# Altium schematic sheet powerSTEP01.SchDoc
size A4; SheetNumber: 5; SheetTotal: 5
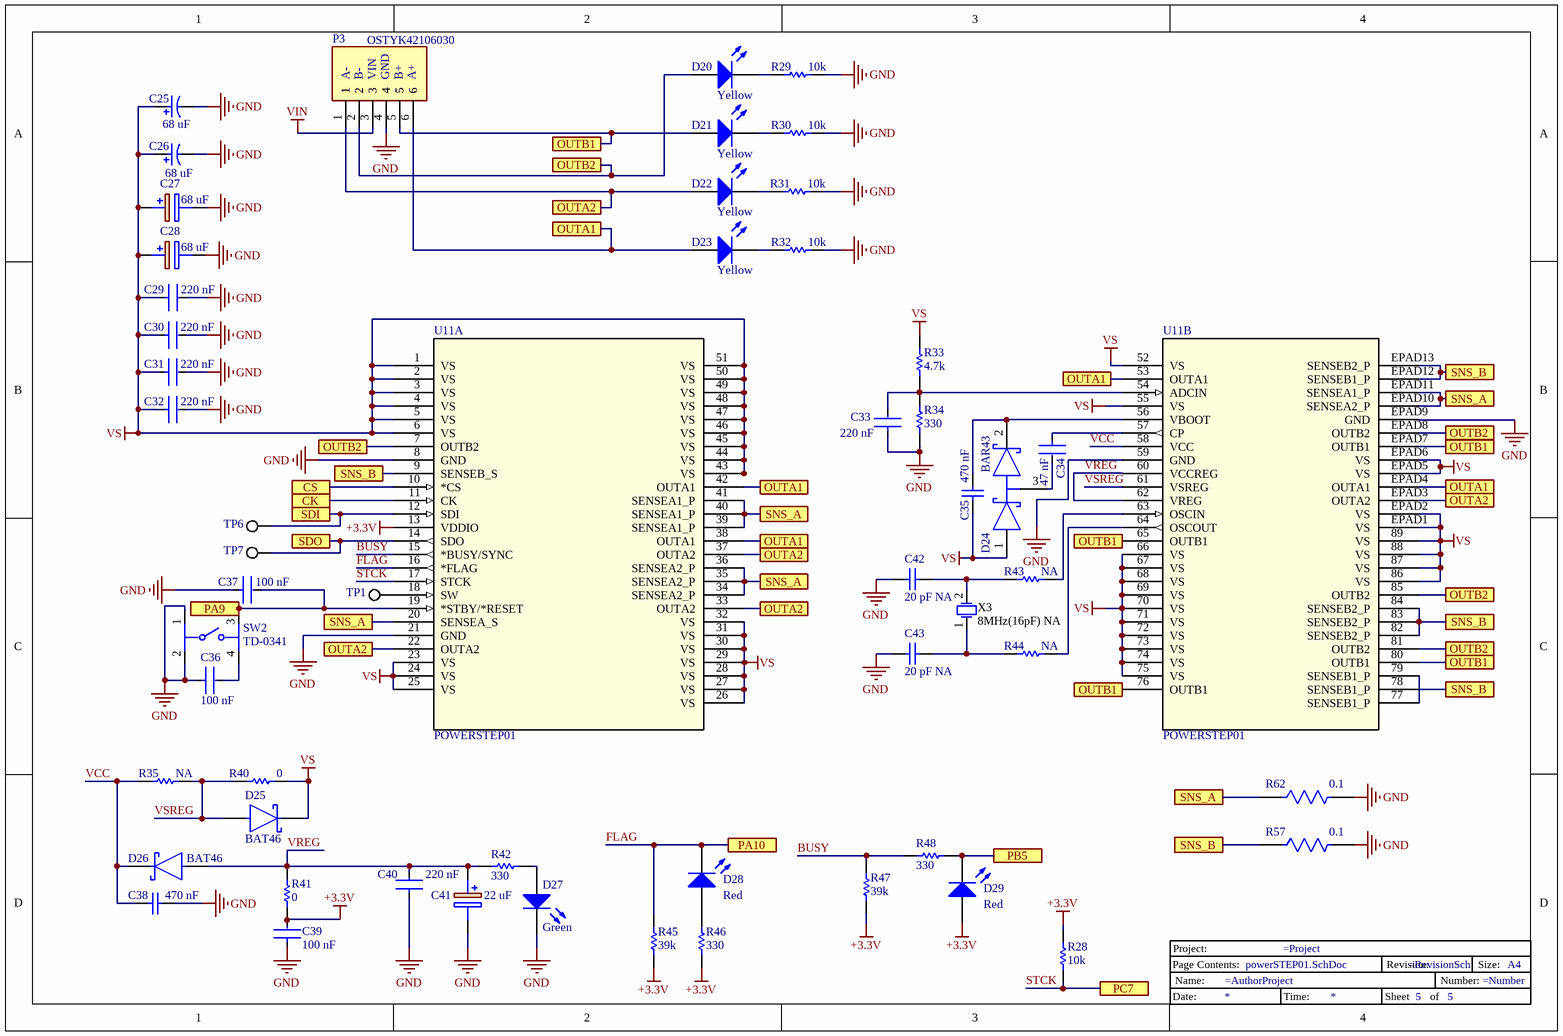
[diagram p0: powerSTEP01.SchDoc]

## Parts
C25  68 uF  [NIC-CAPA2-8X10_V]
C26  68 uF  [NIC-CAPA2-8X10_V]
C27  68 uF  [CAPPRD350W65D800H1300]
C28  68 uF  [CAPPRD350W65D800H1300]
C29  220 nF  [FP-C0805C-DN-MFG]
C30  220 nF  [FP-C0805C-DN-MFG]
C31  220 nF  [FP-C0805C-DN-MFG]
C32  220 nF  [FP-C0805C-DN-MFG]
C33  220 nF  [FP-C0805C-DN-MFG]
C34  47 nF  [FP-CL21-IPC_B]
C35  470 nF  [CAPC1608X90X35ML10T15]
C36  100 nF  [FP-CC0603-DA-MFG]
C37  100 nF  [FP-CC0603-DA-MFG]
C38  470 nF  [CAPC1608X90X35ML10T15]
C39  100 nF  [FP-CC0603-DA-MFG]
C40  220 nF  [FP-C0805C-DN-MFG]
C41  22 uF  [CAPPM3216X180N]
C42  20 pF NA  [CAPC1608X90X35NL15T15]
C43  20 pF NA  [CAPC1608X90X35NL15T15]
D20  Yellow  [0805_A]
D21  Yellow  [0805_A]
D22  Yellow  [0805_A]
D23  Yellow  [0805_A]
D24  BAR43  [FP-SOT23-3L-MFG]
D25  BAT46  [FP-S8-V-3910_01-001-MFG]
D26  BAT46  [FP-S8-V-3910_01-001-MFG]
D27  Green  [0805_A]
D28  Red  [0805_A]
D29  Red  [0805_A]
P3  OSTYK42106030  [OSTYK42106030]
R28  10k  [RESC1608X55X25ML10T15]
R29  10k  [RESC1608X55X25ML10T15]
R30  10k  [RESC1608X55X25ML10T15]
R31  10k  [RESC1608X55X25ML10T15]
R32  10k  [RESC1608X55X25ML10T15]
R33  4.7k  [RESC1609X50X30NL8T20]
R34  330  [RESC1608X55X30LL20T20]
R35  NA  [RESC1608X55X25ML10T15]
R40  0  [RESC1608X55X25ML10T15]
R41  0  [RESC1608X55X25ML10T15]
R42  330  [RESC1608X55X30LL20T20]
R43  NA  [RESC1608X55X25ML10T15]
R44  NA  [RESC1608X55X25ML10T15]
R45  39k  [RESC1608X55X30LL20T20]
R46  330  [RESC1608X55X30LL20T20]
R47  39k  [RESC1608X55X30LL20T20]
R48  330  [RESC1608X55X30LL20T20]
R57  0.1  [FP-WSL2512-MFG]
R62  0.1  [FP-WSL2512-MFG]
SW2  TD-0341  [FP-1571563-9-MFG]
Title_Block_5  Title_Block  (value not drawn)
TP1  5000  [KSTN-5002]  (value not drawn)
TP6  5000  [KSTN-5002]  (value not drawn)
TP7  5000  [KSTN-5002]  (value not drawn)
U11  POWERSTEP01  [VFQFPN89_11X14X1_STM]  (parts A,B of 2)
X3  8MHz(16pF) NA  [FOX-FOXSLF160-20]

## Ports
CK, CS, OUTA1, OUTA2, OUTB1, OUTB2, PA9, PA10, PB5, PC7, SDI, SDO, SNS_A, SNS_B

## Nets
+3.3V: C39.2 D29.2(A) R28.2 R41.2 R45.1 R46.1 R47.1 U11.13(VDDIO)
GND: C25.2 C26.2 C27.2(-) C28.2(-) C29.2 C30.2 C31.2 C32.2 C33.1 C36.1 C37.1 C38.1 C39.1 C40.1 C41.2(-) C42.1 C43.1 D27.1(K) P3.4 R29.2 R30.2 R31.2 R32.2 R34.1 R57.2 R62.2 SW2.1 SW2.2 U11.8(GND) U11.21(GND) U11.59(GND) U11.EPAD9(GND)
VIN: P3.3
VS: C25.1 C26.1 C27.1(+) C28.1(+) C29.1 C30.1 C31.1 C32.1 C35.1 D24.1(A2) D25.1(C) R33.2 R40.2 U11.1(VS) U11.2(VS) U11.3(VS) U11.4(VS) U11.5(VS) U11.6(VS) U11.23(VS) U11.24(VS) U11.25(VS) U11.26(VS) U11.27(VS) U11.28(VS) U11.29(VS) U11.30(VS) U11.31(VS) U11.32(VS) U11.43(VS) U11.44(VS) U11.45(VS) U11.46(VS) U11.47(VS) U11.48(VS) U11.49(VS) U11.50(VS) U11.51(VS) U11.52(VS) U11.55(VS) U11.66(VS) U11.67(VS) U11.68(VS) U11.69(VS) U11.70(VS) U11.71(VS) U11.72(VS) U11.73(VS) U11.74(VS) U11.75(VS) U11.86(VS) U11.87(VS) U11.88(VS) U11.89(VS) U11.EPAD1(VS) U11.EPAD2(VS) U11.EPAD5(VS) U11.EPAD6(VS)
BUSY: R47.2 R48.2 U11.15(*BUSY/SYNC)
CK: U11.11(CK) ; port CK
CS: U11.10(*CS) ; port CS
FLAG: D28.1(K) R45.2 U11.16(*FLAG) ; port PA10
OUTA1: D23.2(A) P3.6 U11.38(OUTA1) U11.42(OUTA1) U11.53(OUTA1) U11.EPAD4(OUTA1) ; port OUTA1
OUTA2: D22.2(A) P3.1 U11.22(OUTA2) U11.33(OUTA2) U11.37(OUTA2) U11.EPAD3(OUTA2) ; port OUTA2
OUTB1: D21.2(A) P3.5 U11.65(OUTB1) U11.76(OUTB1) U11.80(OUTB1) U11.EPAD7(OUTB1) ; port OUTB1
OUTB2: D20.2(A) P3.2 U11.7(OUTB2) U11.81(OUTB2) U11.85(OUTB2) U11.EPAD8(OUTB2) ; port OUTB2
PA9: C37.2 SW2.3 U11.19(*STBY/*RESET) ; port PA9
PB5: D29.1(K) R48.1 ; port PB5
SDI: TP6.1 U11.12(SDI) ; port SDI
SDO: TP7.1 U11.14(SDO) ; port SDO
SNS_A: R62.1 U11.20(SENSEA_S) U11.34(SENSEA2_P) U11.35(SENSEA2_P) U11.36(SENSEA2_P) U11.39(SENSEA1_P) U11.40(SENSEA1_P) U11.41(SENSEA1_P) U11.EPAD10(SENSEA2_P) U11.EPAD11(SENSEA1_P) ; port SNS_A
SNS_B: R57.1 U11.9(SENSEB_S) U11.77(SENSEB1_P) U11.78(SENSEB1_P) U11.79(SENSEB1_P) U11.82(SENSEB2_P) U11.83(SENSEB2_P) U11.84(SENSEB2_P) U11.EPAD12(SENSEB1_P) U11.EPAD13(SENSEB2_P) ; port SNS_B
STCK: R28.1 U11.17(STCK) ; port PC7
VCC: C38.2 D26.1(C) R35.1 U11.58(VCC)
VREG: C40.2 C41.1(+) D26.2(A) R41.1 R42.2 U11.60(VCCREG) U11.62(VREG)
VSREG: D25.2(A) R35.2 R40.1 U11.61(VSREG)
NetC33_2: C33.2 R33.1 R34.2 U11.54(ADCIN)
NetC34_1: C34.1 U11.57(CP)
NetC34_2: C34.2 D24.3(A1/K2)
NetC35_2: C35.2 D24.2(K1) U11.56(VBOOT)
NetC36_2: C36.2 SW2.4
NetC42_2: C42.2 R43.1 X3.2
NetC43_2: C43.2 R44.1 X3.1
NetD20_1: D20.1(K) R29.1
NetD21_1: D21.1(K) R30.1
NetD22_1: D22.1(K) R31.1
NetD23_1: D23.1(K) R32.1
NetD27_2: D27.2(A) R42.1
NetD28_2: D28.2(A) R46.2
NetR43_2: R43.2 U11.63(OSCIN)
NetR44_2: R44.2 U11.64(OSCOUT)
NetTP1_1: TP1.1 U11.18(SW)

## Notes on the sheet
- (near P3) A-
- (near P3) B-
- (near P3) VIN
- (near P3) GND
- (near P3) B+
- (near P3) A+
- (in symbol Title_Block) Project:; Page Contents:; Revision:; Size:; A4; Name:; Number:; Date:; Time:; Sheet; of

## Library data of the parts
C25 C26 = CMP-0687-00076-1: Aluminum Electrolytic Capacitor, UD Series, Low Impedance, 68 uF, 50 V, + / - 20%, -55 to 105 degC, Chip Type, 8 x 10 mm D x L, Pb-Free, Reel UUD1H680MNL1GS; Manufacturer: Nichicon; Endurance Time: 2000 h; Rated Ripple Current (at 100kHz): 300 mA; Packing: Dia382mm Reel; Impedance: 0.34 Ohm; Tolerance Rated Capacitance: -20 to 20%; Rated Voltage: 50 V; ComponentLink3URL: http://products.nichicon.co.jp/en/pdf/XJA043/e-ud.pdf; ComponentLink2Description: Datasheet; Length: 10 mm; ComponentLink1Description: Manufacturer URL; ComponentLink3Description: Package Specification; ComponentLink2URL: http://products.nichicon.co.jp/en/pdf/XJA043/e-ud.pdf; PackageReference: CAPAE-D8H10; Rated Capacitance: 68 uF; PackageDescription: 2-Pin Surface Mount Device, Diameter 8 mm, Height 10 mm, Pitch 6.5 mm; RoHS: TRUE; PartNumber: UUD1H680MNL1GS; Mounting Technology: Surface Mount; DatasheetVersion: 08/2012; Diameter: 8 mm; ComponentLink1URL: http://www.nichicon.co.jp/
C27 C28 = EEU-FC1H680B: Capacitor Polarised; Manufacturer_Name: Panasonic; Datasheet Link: https://componentsearchengine.com/Datasheets/1/EEU-FC1H680B.pdf; Height: 13mm; Manufacturer_Part_Number: EEU-FC1H680B; Mouser Part Number: 667-EEU-FC1H680B; Mouser Price/Stock: https://www.mouser.co.uk/ProductDetail/Panasonic/EEU-FC1H680B?qs=LJ9%2FzSqIxRzRhFJo5GKaVg%3D%3D; Arrow Part Number: EEU-FC1H680B; Arrow Price/Stock: https://www.arrow.com/en/products/eeu-fc1h680b/panasonic
C29-C33 C40 = CMP-1036-04552-2: CAP CER 0.22UF 50V X7R 0805; Manufacturer: KEMET; Manufacturer Part Number: C0805C224K5RACTU; Value: 0.22 μF; Temperature Coefficient: 30ppm/°C; Material: Ceramic; Tolerance: 0.1; ComponentLink2URL: https://content.kemet.com/datasheets/KEM_C1003_C0G_SMD.pdf; Temperature Characteristic: X7R; Device Class L3: Ceramic Capacitors; Lead Free: Yes; Temperature: -55°C to +125°C; RoHS: TRUE; Capacitance: 0.22 μF; Automotive: No; Octopart: https://octopart.com/c0805c224k5ractu-kemet-144670; Temperature Range Low: -55°C; Height: 0.88mm; Device Class L1: Passive Components; Digikey Description: CAP CER 0.22UF 50V X7R 0805; ComponentLink2Description: Datasheet; Mouser Description: CAP CER 0.22UF 50V X7R 0805; Category: Cap; Ipc Land Pattern Name: CAPC200125X78; Temperature Range High: +125°C; Package: C0805C-DN; Device Class L2: Capacitors; Voltage Rating: 50 V
C34 = CMP-13271-004199-1: CL21 Series 0805 47nF 50V ±5% Tolerance X7R Multilayer Ceramic Chip Capacitor; Thickness: 0.037inch; Length: 2mm; Voltage Rating (DC): 50V; Width: 0.049inch; Case/Package: 0805; Mount: Surface Mount; Case Code (Imperial): 0805; Package Quantity: 1; Capacitance: 47nF; Packaging: Tape and Reel; Voltage: 50V; Material: Ceramic; Max Operating Temperature: 125°C; Radiation Hardening: No; Min Operating Temperature: -55°C; Height: 0.85mm; Voltage Rating: 50V; Depth: 1.25mm; Tolerance: 5%; Case Code (Metric): 2012; Dielectric: X7R
C35 C38 = CMP-2006-02821-1: Part Number: GRM188R61E474KA12D; Manufacturer: Murata
C36 C37 C39 = CMP-2100-03601-2: CAP CER 0.1UF 50V X7R 0603; Manufacturer: YAGEO; Manufacturer Part Number: CC0603KRX7R9BB104; Material: Ceramic; Temperature Coefficient: 15%; Tolerance: 0.1; Height: 0.9mm; Voltage: 50 V; ComponentLink2Description: Datasheet; Device Class L2: Capacitors; Temperature Range High: +125°C; Category: Cap; Capacitance: 100 nF; Footprint Url: http://www.yageo.com/exep/pages/download/literatures/UPY-C_GEN_24.pdf; ComponentLink2URL: http://www.yageo.com/documents/recent/UPY-GPHC_X7R_6.3V-to-50V_18.pdf; Package: CC0603-DA; Temperature: -55°C to +125°C; Voltage Rating: 50 V; Temperature Characteristic: X7R; Device Class L1: Passive Components; Temperature Range Low: -55°C; RoHS: TRUE; Automotive: No; Value: 100 nF; Device Class L3: Ceramic Capacitors; Octopart: https://octopart.com/cc0603krx7r9bb104-yageo-42244635; Mouser Description: Multilayer Ceramic Capacitor, CC Series, 0.1 - F, - 10%, X7R, 50 V, 0603 [1608 Metric]; Lead Free: Yes; Digikey Description: CAP CER 0.1UF 50V X7R 0603
C41 = T495A226K006ATE500: Capacitor Polarised 22 uF TANT; Manufacturer_Name: Kemet; Datasheet Link: https://componentsearchengine.com/Datasheets/2/T495A226K006ATE500.pdf; Height: 1.8mm; Manufacturer_Part_Number: T495A226K006ATE500; Mouser Part Number: 80-T495A226K06ATE500; Mouser Price/Stock: https://www.mouser.com/Search/Refine.aspx?Keyword=80-T495A226K06ATE500; Arrow Part Number: T495A226K006ATE500; Arrow Price/Stock: https://www.arrow.com/en/products/t495a226k006ate500/kemet-corporation
C42 C43 = CMP-2006-04264-1: Part Number: 06035A200JAT2A; Manufacturer: AVX Interconnect / Elco
D20-D23 = CMP-1426-00012-1: SMD mono-color Chip LED, WL-SMCW, Yellow; Manufacturer: Wuerth Elektronik; PartNumber: 150080YS75000; Color: Yellow; ComponentLink1URL: http://www.we-online.com; PackageReference: 0805_A; ComponentLink2URL: http://katalog.we-online.com/led/datasheet/150080YS75000.pdf; ComponentLink1Description: Manufacturer URL; ComponentLink2Description: Datasheet
D24 = CMP-2000-05915-2: DIODE ARRAY SCHOTTKY 30V SOT23-3; Manufacturer: STMicroelectronics; Manufacturer Part Number: BAR43SFILM; Forward Current: 0.1A; Peak Reverse Current: 0.5uA; Standoff Height: 0mm; Value: 7pF; Max Junction Temp: +150°C; Max Surge Forward Current: 0.75A; Max Repetitive Reverse Voltage: 30V; ComponentLink2Description: Datasheet; Mouser Description: Schottky Diodes & Rectifiers 100mA 30 Volt; Octopart: https://octopart.com/bar43sfilm-stmicroelectronics-39549077; Temperature: to +150°C; Category: Diode; Lead Free: Yes; Device Class L3: Schottky Diodes; Device Class L1: Discrete Semiconductors; RoHS: TRUE; ComponentLink2URL: https://www.st.com/resource/en/datasheet/bar43.pdf; Device Class L2: Diodes; Package: SOT23-3L; Height: 1.5mm; Automotive: No; Capacitance: 7pF; Temperature Range High: +150°C; Digikey Description: DIODE ARRAY SCHOTTKY 30V SOT23-3
D25 D26 = CMP-02539-000007-1: DIODE SCHOTTKY 100V 150MA SOD123; Manufacturer Part Number: BAT46W-E3-08; Manufacturer: Vishay; Max Junction Temp: +125°C; Capacitance: 10pF; Max Surge Forward Current: 750mA; Value: 10pF; Peak Reverse Current: 5uA; Automotive: No; ComponentLink2URL: http://www.vishay.com/docs/85663/bat46wv.pdf; Reverse Voltage: 100V; Max Repetitive Reverse Voltage: 100V; Mouser Description: BAT46W Series 100 V 150 mA Surface Mount Small Signal Schottky Diode - SOD-123; Device Class L2: Diodes; Temperature Range High: +125°C; Temperature: -55°C to +125°C; Category: Diode; ComponentLink2Description: Datasheet; Device Class L3: Schottky Diodes; Height: 1.35mm; Lead Free: Yes; Octopart: https://octopart.com/bat46w-e3-08-vishay-30324836; Temperature Range Low: -55°C; RoHS: TRUE; Device Class L1: Discrete Semiconductors; Package: S8-V-3910.01-001; Digikey Description: DIODE SCHOTTKY 100V 150MA SOD123; Forward Current: 150mA
D27 = CMP-1426-00009-1: SMD mono-color Chip LED, WL-SMCW, Bright Green; PartNumber: 150080VS75000; Manufacturer: Wuerth Elektronik; ComponentLink1Description: Manufacturer URL; Color: Bright Green; PackageReference: 0805_A; ComponentLink1URL: http://www.we-online.com; ComponentLink2Description: Datasheet; ComponentLink2URL: http://katalog.we-online.com/led/datasheet/150080VS75000.pdf
D28 D29 = CMP-1426-00011-1: SMD mono-color Chip LED, WL-SMCW, Red; PartNumber: 150080RS75000; Manufacturer: Wuerth Elektronik; Color: Red; PackageReference: 0805_A; ComponentLink2Description: Datasheet; ComponentLink1URL: http://www.we-online.com; ComponentLink1Description: Manufacturer URL; ComponentLink2URL: http://katalog.we-online.com/led/datasheet/150080RS75000.pdf
P3 = OSTYK42106030: Connector; Manufacturer_Name: On-Shore Technology; Datasheet Link: https://www.arrow.com/en/products/ostyk42106030/on-shore-technology; Height: 13mm; Manufacturer_Part_Number: OSTYK42106030; Arrow Part Number: OSTYK42106030; Arrow Price/Stock: https://www.arrow.com/en/products/ostyk42106030/on-shore-technology
R28-R32 = CMP-2000-05022-1: Resistor, 10 kOhm, +/- 5%, 100 mW, -55 to 155 degC, 0603 (1608 Metric), RoHS, Tape and Reel; Manufacturer: Yageo; Resistance: 10kOhms; Voltage Rating: 50V; Temperature Coefficient: 100PPM/C; Power Rating: 100mW; Package Reference: 603; Series: RC; Case Code - mm: 1608; Packaging: Reel; Datasheet URL: http://www.farnell.com/datasheets/443971.pdf; Datasheet Version: Rev. 4, 04/2009; Operating Temperature Range: -55Cto+155C; Product: ThickFilmResistorsGeneralPurpose; Package Description: 2-Pin Surface Mount Device, Body 1.6 x 0.8 mm; Manufacturer URL: http://www.yageo.com/; Case Code - in: 0603; Tolerance: 5%; Termination Style: SMD/SMT
R33 = CMP-2000-03816-5: Chip Resistor, 4.7 kOhm, Jumper, 100 mW, -55 to 155 degC, 0603 (1608 Metric), RoHS, Tape and Reel; Manufacturer: Vishay Semiconductor; Voltage Rating: 75 V; Package Quantity: 5000; DatasheetVersion: 06/2012; Min Operating Temperature: -55 degC; ComponentLink1URL: http://www.vishay.com/; Mounting Technology: Surface Mount; Height: 0.45 mm; ComponentLink1Description: Manufacturer URL; REACH SVHC: Unknown; PackageReference: 0603; Packaging: Tape and Reel; Max Operating Temperature: 155 degC; Mount: Surface Mount; ComponentLink2Description: Datasheet; PackageDescription: 2-Pin Surface Mount Device, Body 1.575 x 0.85 mm; Length: 1.55 mm; ComponentLink2URL: http://www.vishay.com/docs/20035/dcrcwe3.pdf; Pins: 2; RoHSCompliant: true
R34 R42 R46 R48 = CMP-2000-00042-1: Chip Resistor, 330 / Ohm, +/- 5%, 0.1 W, - / 55 to 155 degC, 0603 / (1608 Metric), RoHS, / Tape and Reel; Part Number: ERA3AEB334V; Manufacturer: Panasonic
R35 R40 R41 R43 R44 = CMP-2100-03667-1: Chip Resistor, 0 Ohm, +/- 5%, 0.1 W, -55 to 155 degC, 0603 (1608 Metric), RoHS, Tape and Reel; Manufacturer: Yageo; Temperature Coefficient: 200ppm/degreesC; Voltage Rating: 50V; Power Rating: 100mW; Resistance: 0mOhm; Width: 0.8mm; Max Operating Temperature: 155degC; Tolerance: 5%; Package Reference: 0603; Height: 0.45mm; Depth: 0.8mm; Package Description: 2-Pin Surface Mount Device, Body 1.6 x 0.8 mm; Termination: SMD/SMT; Package Quantity: 5000; Case/Package: 0603; Case Code (Imperial): 0603; Radiation Hardening: No; Number of Pins: 2; Length: 1.6mm; Lead Free: LeadFree; Voltage Rating (DC): 50V; Military Standard: Not; Datasheet URL: http://www.yageo.com/NewPortal/yageodocoutput?fileName=/pdf/R-Chip/PYu-RC_Group_51_RoHS_L_5.pdf; Manufacturer URL: http://www.yageo.com/; Packaging: TapeandReel; Case Code (Metric): 1608; Min Operating Temperature: -55degC; Composition: ThickFilm; RoHSCompliant: true; Contact Plating: Tin; Datasheet Version: Rev. 5, 10/2016; REACH SVHC: NoSVHC
R45 R47 = CMP-2000-00055-1: 0603; Part Number: ERA-3AEB393V; Manufacturer: Panasonic
R57 = CMP-2000-07420-2: RES 0.05 OHM 1% 1W 2512; Manufacturer: Vishay; 3DS Part Number: 110-00001; Manufacturer Part Number: WSL2512R0500FEA; Resistance: 50mΩ; Temperature Coefficient: 75ppm/°C; Automotive Grade: Grade 0; Value: 50mΩ; Automotive: Yes; Tolerance: 1%; Device Class L3: Chip SMD Resistors; Category: Res; Package: WSL2512; Lead Free: Yes; Octopart: https://octopart.com/wsl2512r0500fea-vishay-39744678; ComponentLink2URL: http://www.vishay.com/docs/30100/wsl.pdf; Height: 0.889mm; Composition: Metal Element; Temperature Range High: +170°C; ComponentLink2Description: Datasheet; Digikey Description: RES 0.05 OHM 1% 1W 2512; Series: WSL; Temperature: -65°C to +170°C; Temperature Range Low: -65°C; Device Class L1: Passive Components; RoHS: TRUE; Power Rating: 1W; Ipc Land Pattern Name: RESC635318X64; Device Class L2: Resistors
R62 = CMP-2000-07420-2: RES 0.1 OHM 1% 2W 2512; Manufacturer: Vishay; 3DS Part Number: 110-00001; Manufacturer Part Number: WSL2512R0500FEA; Resistance: 50mΩ; Temperature Coefficient: 75ppm/°C; Automotive Grade: Grade 0; Value: 50mΩ; Power Rating: 1W; Automotive: Yes; Tolerance: 1%; Device Class L3: Chip SMD Resistors; Category: Res; Package: WSL2512; Lead Free: Yes; Octopart: https://octopart.com/wsl2512r0500fea-vishay-39744678; ComponentLink2URL: http://www.vishay.com/docs/30100/wsl.pdf; Height: 0.889mm; Composition: Metal Element; Temperature Range High: +170°C; ComponentLink2Description: Datasheet; Digikey Description: RES 0.05 OHM 1% 1W 2512; Series: WSL; Temperature: -65°C to +170°C; Temperature Range Low: -65°C; Device Class L1: Passive Components; RoHS: TRUE; Ipc Land Pattern Name: RESC635318X64; Device Class L2: Resistors
SW2 = CMP-03402-000005-1: SWITCH TACTILE SPST-NO 0.05A 24V; Manufacturer: TE Connectivity; Manufacturer Part Number: 1571563-9; Standoff Height: 0.05mm; Electromechanical Life: 100000Cycles; Contact Resistance: 100mΩ; Operating Force: 160gf; Contact Current Rating: 50mA; Automotive: No; Device Class L1: Electromechanical; Voltage Rating Dc: 24V; ComponentLink2Description: Datasheet; Mount: Surface Mount; RoHS: TRUE; Temperature: -35°C to +85°C; ComponentLink2URL: https://www.te.com/commerce/DocumentDelivery/DDEController?Action=showdoc&DocId=Customer+Drawing%7F2-1437565-7%7FV%7Fpdf%7FEnglish%7FENG_CD_2-1437565-7_V.pdf%7F1571563-9; Temperature Range Low: -35°C; Lead Free: Yes; Device Class L2: Switches; Package: SMT_SW_6MM0_6MM0; Octopart: https://octopart.com/1571563-9-te+connectivity-41253969; Throw Configuration: SPST-NO; Mouser Description: Tactile Switches SPST OFF(ON) RND SMT MINI PB TACT SWITCH; Temperature Range High: +85°C; Digikey Description: SWITCH TACTILE SPST-NO 0.05A 24V; Device Class L3: Pushbutton Switches; Category: Switch; Height: 9.75mm
TP1 TP6 TP7 = CMP-2000-05182-1: Test Point, White, 1-Pin THD, RoHS, Bulk; Manufacturer: KeystoneElectronics; Outside Diameter: 2.54mm; Plating: Silver; Mounting Hole Size: 1mm; Product: TestPoints; Packaging: Bulk; Manufacturer URL: http://www.keyelco.com/; Length: 7.62mm; Datasheet Version: Rev. G, 12/2008; Type: Miniature; Product Category: CircuitBoardHardware-PCB; Material: Nylon; RoHS: True; Contact Material: PhosphorBronze; Datasheet URL: https://ciiva.com/datasheet-click-2917627?src=ciiva&sig=bd195616; Color: White; Brand: KeystoneElectronics
U11 = POWERSTEP01: No Description Available; Vendor: STMicroelectronics; Built_By: EMA_Cory; SourceLibrary: Add_to_database_2020-12-10; Datasheet: https://www.st.com/resource/en/datasheet/powerstep01.pdf; Manufacturer_Part_Number: POWERSTEP01; Copyright: Copyright (C) 2018 Accelerated Designs. All rights reserved; RefDes: RefDes; Type: DEV
X3 = CMP-1749-00003-1: Resistance Weld Thru-Hole Crystal, 16 MHz, -20 to 70 degC, 2-Pin THD, RoHS, Bulk; Voltage Rating: 250 V; Tolerance: 1%; Resistance: 221 kohm; Case\Package: Axial; Power Rating: 250 mW; RoHSCompliant: true; Package Quantity: 200; Packaging: Bulk; Min Operating Temperature: -55 degC; DatasheetVersion: Mar-15; ComponentLink1URL: http://www.foxonline.com/; Max Operating Temperature: 155 degC; PackageReference: FOXSLF160-20; Mount: Through Hole; PackageDescription: 2-Pin Through Hole Device, Body 11.35 x 4.65 mm; ComponentLink1Description: Manufacturer URL; ComponentLink2URL: http://www.foxonline.com/pdfs/hc49slf.pdf; ComponentLink2Description: Datasheet; Length: 0.248 inch